# EAGLE design femtoBeacon_r2.0.1 (EAGLE 7.6.0)

## Sheet 1 of 2
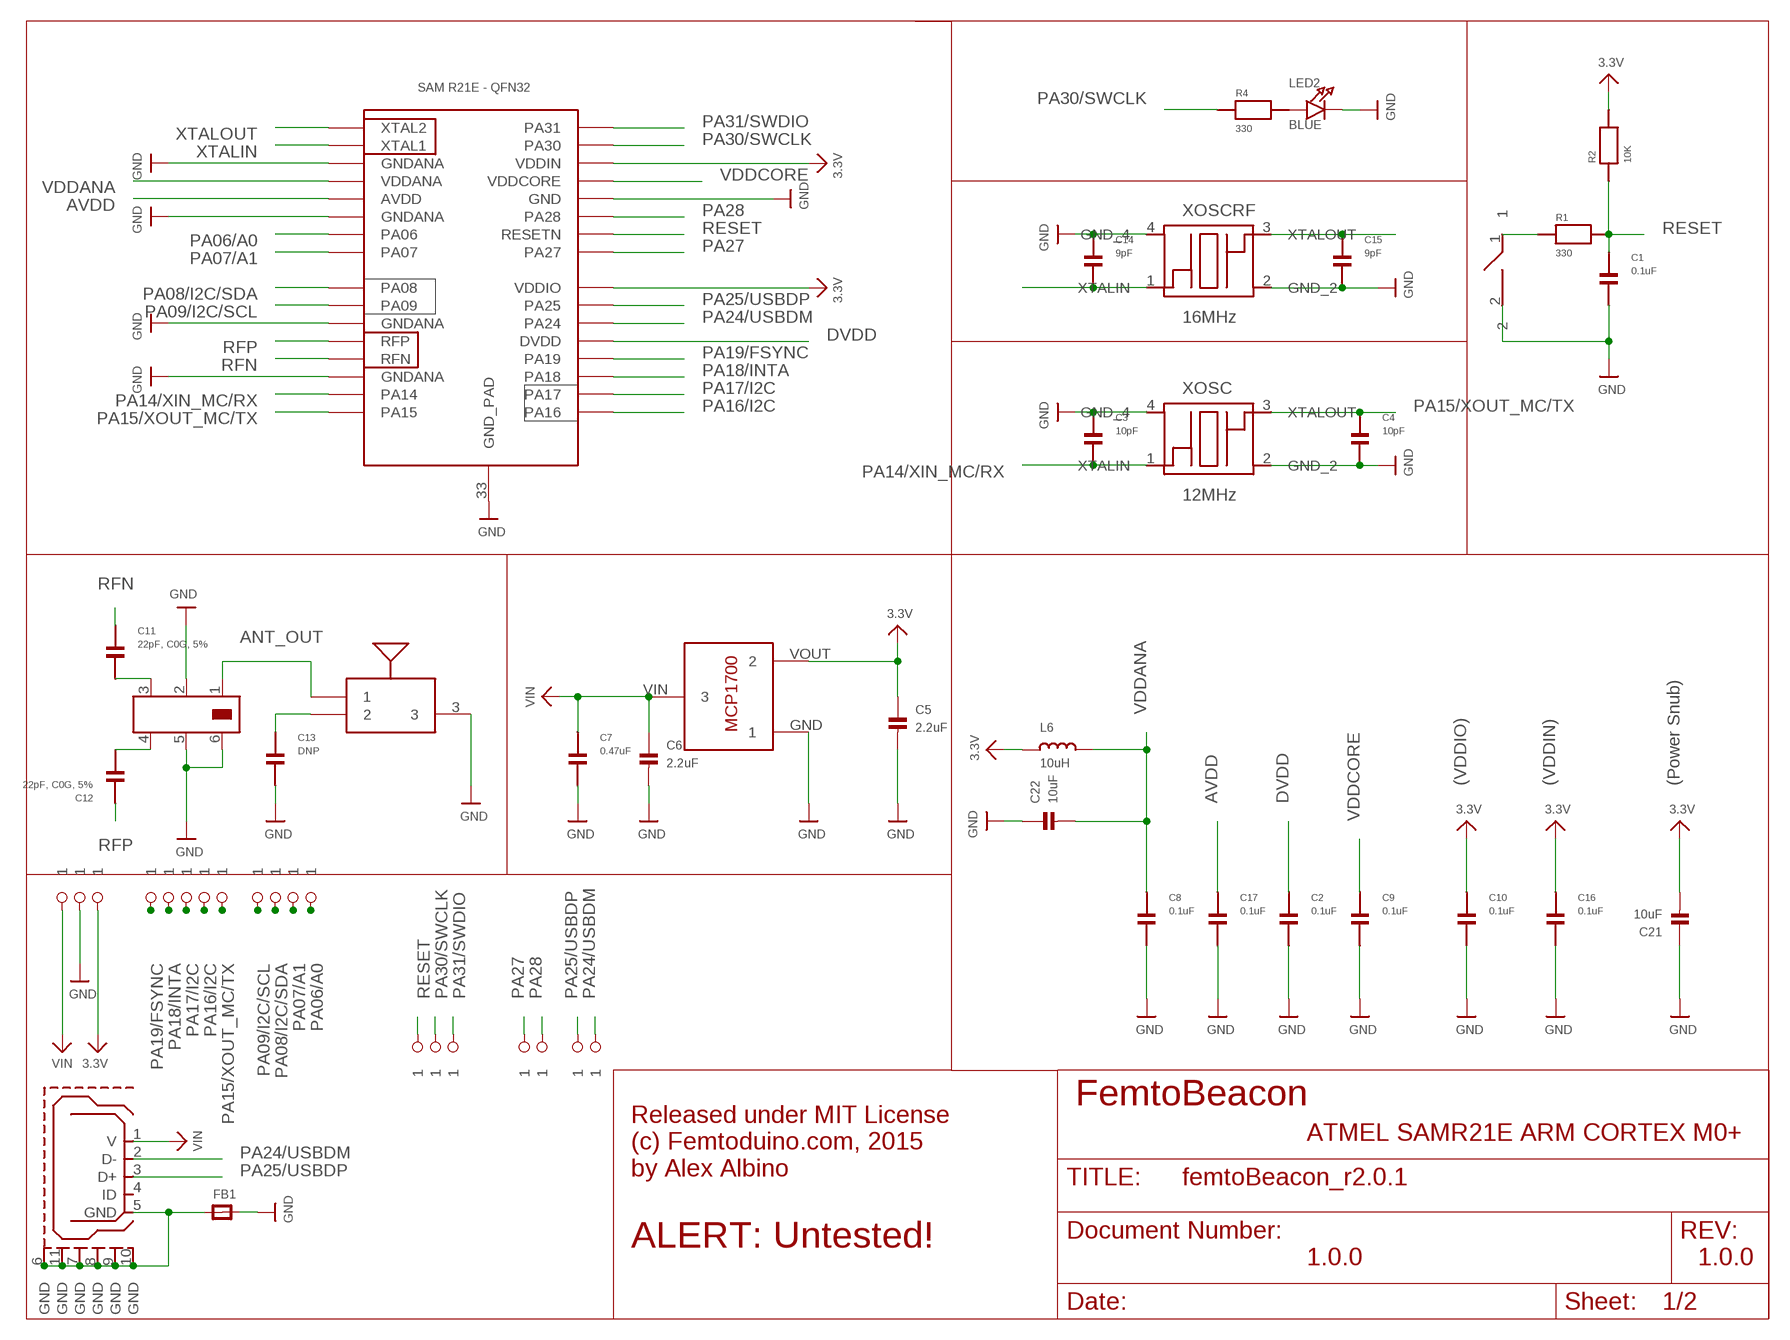
[diagram p0: schematic, sheet 1]

### Parts
ANT1  PULSE_ANT_2.4GHZ  [ANT_BAR]
BAL  JOHANSON_2450BM15A0015E  [0805_BALUN]
BTN  DNP  SPST_SMD  [SPST_SMD]
C1  0.1uF  CAPACITOR_0201  [PART]
C2  0.1uF  CAPACITOR_0201  [PART]
C3  10pF  CAPACITOR_0201  [PART]
C4  10pF  CAPACITOR_0201  [PART]
C5  2.2uF  CAP_CERAMIC_0402MP  [_0402MP]
C6  2.2uF  CAP_CERAMIC_0402MP  [_0402MP]
C7  0.47uF  CAPACITOR_0201  [PART]
C8  0.1uF  CAPACITOR_0201  [PART]
C9  0.1uF  CAPACITOR_0201  [PART]
C10  0.1uF  CAPACITOR_0201  [PART]
C11  22pF, C0G, 5%  CAPACITOR_0201  [PART]
C12  22pF, C0G, 5%  CAPACITOR_0201  [PART]
C13  DNP  CAPACITOR_0201  [PART]
C14  9pF  CAPACITOR_0201  [PART]
C15  9pF  CAPACITOR_0201  [PART]
C16  0.1uF  CAPACITOR_0201  [PART]
C17  0.1uF  CAPACITOR_0201  [PART]
C21  10uF  CAP_CERAMIC_0402MP  [_0402MP]
C22  10uF  CAP_CERAMIC_0402MP  [_0402MP]
FB1  FERRITE_0603MP  [_0603MP]
IC  ATSAMR21E18A-MUT  [QFN32]
L6  10uH  INDUCTOR_0603MP  [_0603MP]
LDO_VREG  MCP1700T-3302E/TT  [MCP1700T-3302E/TT]
LED2  BLUE  LED0603_NOOUTLINE  [CHIPLED_0603_NOOUTLINE]
R1  330  RESISTOR_0201  [PART]
R2  10K  RESISTOR_0201  [PART]
R4  330  RESISTOR_0201  [PART]
U$1  1X1_ROUND  [1X1_ROUND]
U$2  1X1_ROUND  [1X1_ROUND]
U$5  1X1_ROUND  [1X1_ROUND]
U$7  1X1_ROUND  [1X1_ROUND]
U$9  1X1_ROUND  [1X1_ROUND]
U$10  1X1_ROUND  [1X1_ROUND]
U$35  1X1_ROUND  [1X1_ROUND]
U$36  1X1_ROUND  [1X1_ROUND]
U$37  1X1_ROUND  [1X1_ROUND]
U$38  1X1_ROUND  [1X1_ROUND]
U$39  1X1_ROUND  [1X1_ROUND]
U$41  1X1_ROUND  [1X1_ROUND]
U$42  1X1_ROUND  [1X1_ROUND]
U$43  1X1_ROUND  [1X1_ROUND]
U$45  1X1_ROUND  [1X1_ROUND]
U$46  1X1_ROUND  [1X1_ROUND]
U$47  1X1_ROUND  [1X1_ROUND]
U$48  1X1_ROUND  [1X1_ROUND]
U$54  1X1_ROUND  [1X1_ROUND]
USB  USB_MICROB  [USB_MICROB_PACKAGE]
XOSC  12MHz  TSX-3225  [TSX-3225]
XOSCRF  16MHz  TSX-3225  [TSX-3225]

### Nets
3.3V: C5.1 C10.1 C16.1 C21.2 IC.24(VDDIO) IC.30(VDDIN) L6.1 LDO_VREG.VOUT R2.2 U$5.P$1 ; also sheet 2
ANT_OUT: ANT1.1 BAL.1
AVDD: C17.1 IC.5(AVDD)
DVDD: C2.1 IC.21(DVDD)
GND: ANT1.3 BAL.2 BAL.5 BAL.6 BTN.2 C1.2 C2.2 C3.1 C4.2 C5.2 C6.2 C7.2 C8.2 C9.2 C10.2 C13.2 C14.1 C15.2 C16.2 C17.2 C21.1 C22.1 FB1.2 IC.3(GNDANA) IC.6(GNDANA) IC.11(GNDANA) IC.14(GNDANA) IC.28(GND) IC.33(GND_PAD) LDO_VREG.GND LED2.C U$2.P$1 XOSC.2(GND_2) XOSC.4(GND_4) XOSCRF.2(GND_2) XOSCRF.4(GND_4) ; also sheet 2
N$1: BAL.3 C11.2
N$2: ANT1.2 C13.1
N$3: BAL.4 C12.2
N$5: FB1.1 USB.5(GND) USB.6(GND) USB.7(GND) USB.8(GND) USB.9(GND) USB.10(GND) USB.11(GND)
N$13: LED2.A R4.2
N$26: BTN.1 R1.1
PA06/A0: IC.7(PA06) U$54.P$1
PA07/A1: IC.8(PA07) U$43.P$1
PA08/I2C/SDA: IC.9(PA08) U$42.P$1 ; also sheet 2
PA09/I2C/SCL: IC.10(PA09) U$41.P$1 ; also sheet 2
PA14/XIN_MC/RX: C3.2 IC.15(PA14) XOSC.1(XTALIN)
PA15/XOUT_MC/TX: C4.1 IC.16(PA15) U$39.P$1 XOSC.3(XTALOUT)
PA16/I2C: IC.17(PA16) U$38.P$1
PA17/I2C: IC.18(PA17) U$37.P$1
PA18/INTA: IC.19(PA18) U$36.P$1 ; also sheet 2
PA19/FSYNC: IC.20(PA19) U$35.P$1 ; also sheet 2
PA24/USBDM: IC.22(PA24) U$9.P$1 USB.2(D-)
PA25/USBDP: IC.23(PA25) U$10.P$1 USB.3(D+)
PA27: IC.25(PA27) U$7.P$1
PA28: IC.27(PA28) U$48.P$1
PA30/SWCLK: IC.31(PA30) R4.1 U$46.P$1
PA31/SWDIO: IC.32(PA31) U$47.P$1
RESET: C1.1 IC.26(RESETN) R1.2 R2.1 U$45.P$1
RFN: C11.1 IC.13(RFN)
RFP: C12.1 IC.12(RFP)
VDDANA: C8.1 C22.2 IC.4(VDDANA) L6.2
VDDCORE: C9.1 IC.29(VDDCORE)
VIN: C6.1 C7.1 LDO_VREG.VIN U$1.P$1 USB.1(V)
XTALIN: C14.2 IC.2(XTAL1) XOSCRF.1(XTALIN)
XTALOUT: C15.1 IC.1(XTAL2) XOSCRF.3(XTALOUT)
Unconnected: USB.4(ID)

### Notes on the sheet
- (VDDIO) | (VDDIN) | (Power Snub)
- FemtoBeacon
- ATMEL SAMR21E ARM CORTEX M0+
- Released under MIT License
  (c) Femtoduino.com, 2015
  by Alex Albino
- ALERT: Untested!
- 1.0.0 | 1.0.0

## Sheet 2 of 2
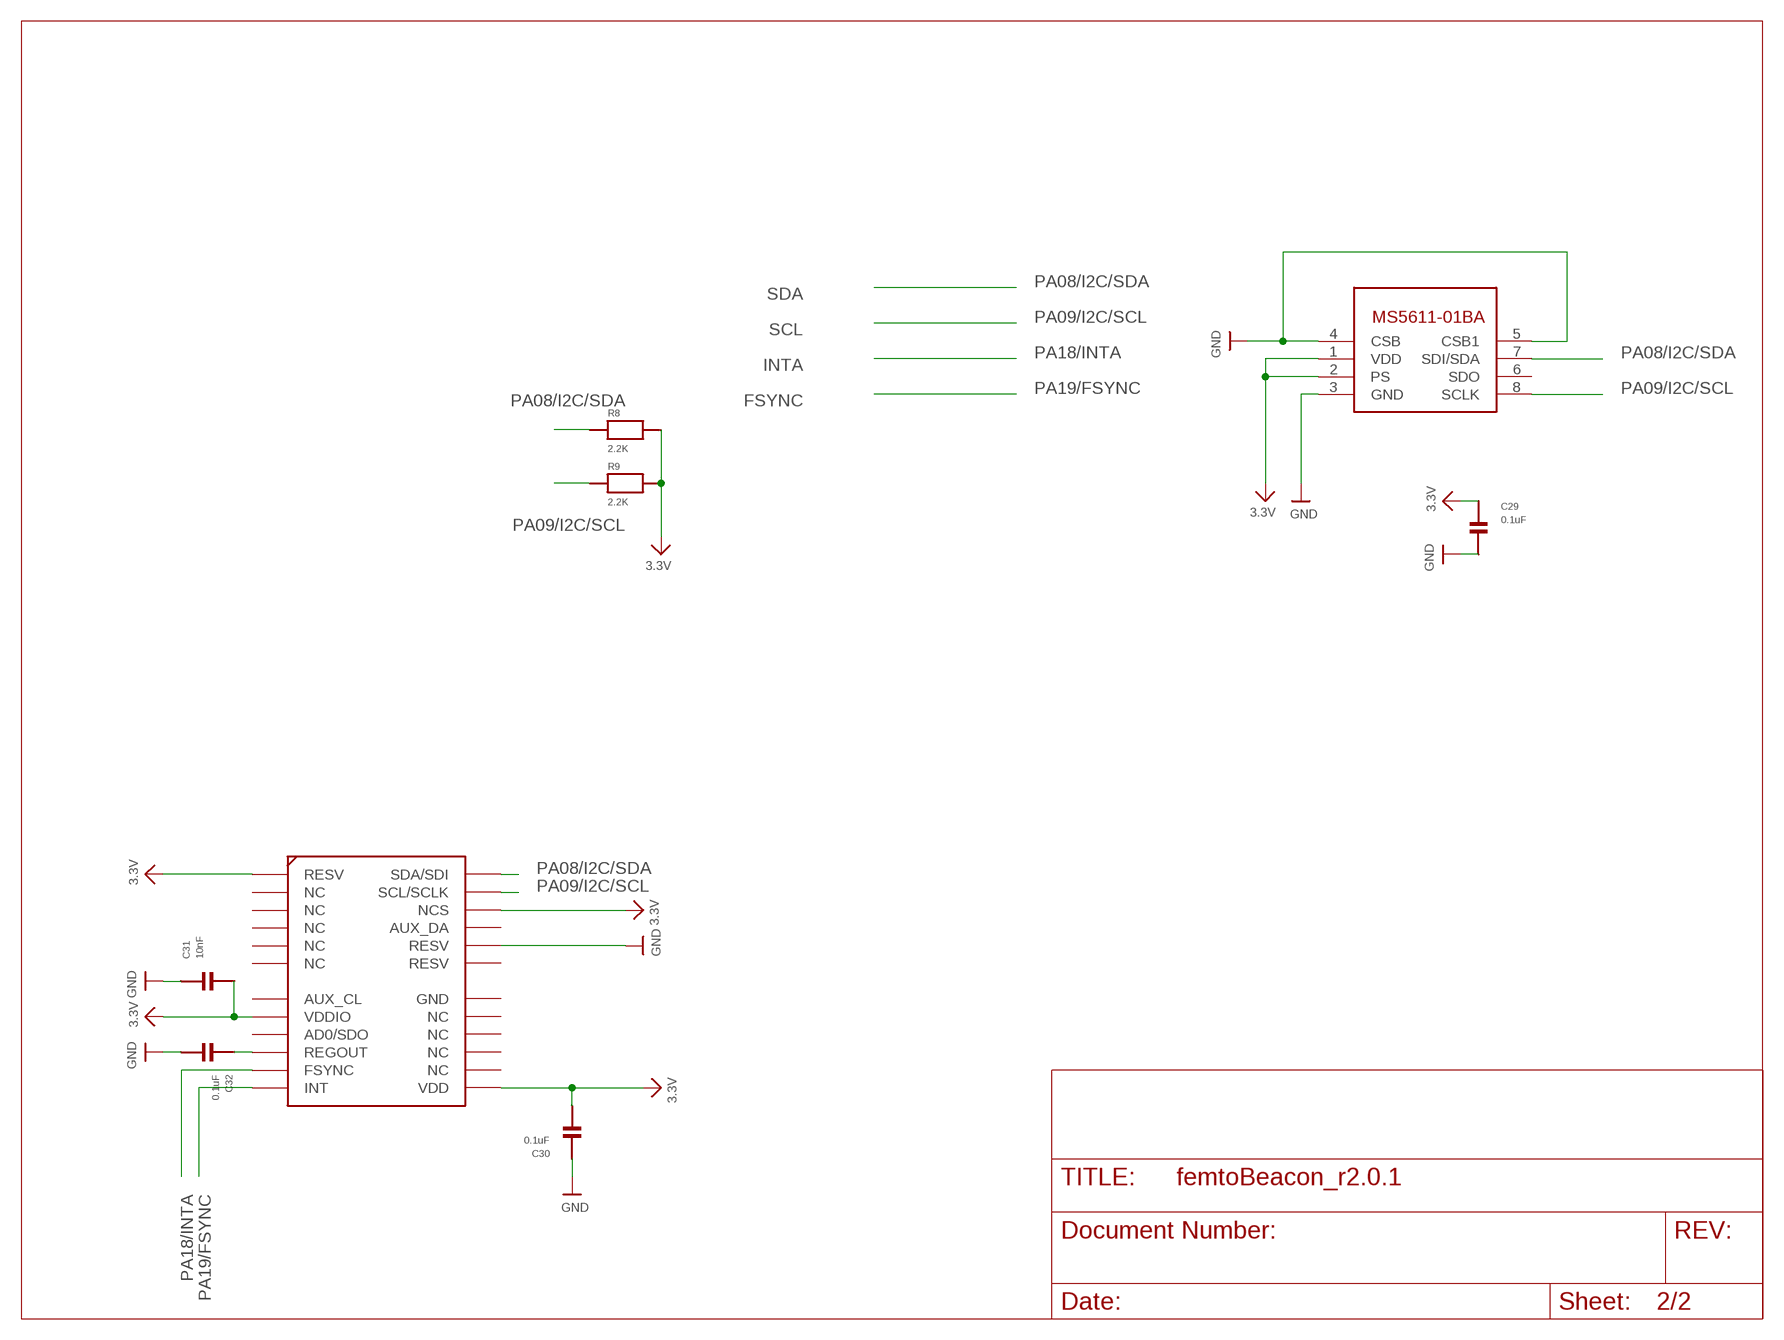
[diagram p1: schematic, sheet 2]

### Parts
BARO  MS5611-01BA03  [MS5611-01BA03]
C29  0.1uF  CAPACITOR_0201  [PART]
C30  0.1uF  CAPACITOR_0201  [PART]
C31  10nF  CAPACITOR_0201  [PART]
C32  0.1uF  CAPACITOR_0201  [PART]
IMU  MPU-9250  [QFN_3X3MM]
R8  2.2K  RESISTOR_0201  [PART]
R9  2.2K  RESISTOR_0201  [PART]

### Nets
3.3V: BARO.1(VDD) BARO.2(PS) C29.1 C30.2 C31.2 IMU.P$1(RESV) IMU.P$8(VDDIO) IMU.P$13(VDD) IMU.P$22(NCS) R8.2 R9.2 ; also sheet 1
GND: BARO.3(GND) BARO.4(CSB) BARO.5(CSB1) C29.2 C30.1 C31.1 C32.2 IMU.P$20(RESV) ; also sheet 1
N$4: C32.1 IMU.P$10(REGOUT)
PA08/I2C/SDA: BARO.7(SDI/SDA) IMU.P$24(SDA/SDI) R8.1 ; also sheet 1
PA09/I2C/SCL: BARO.8(SCLK) IMU.P$23(SCL/SCLK) R9.1 ; also sheet 1
PA18/INTA: IMU.P$11(FSYNC) ; also sheet 1
PA19/FSYNC: IMU.P$12(INT) ; also sheet 1
Unconnected: BARO.6(SDO) IMU.P$2(NC) IMU.P$3(NC) IMU.P$4(NC) IMU.P$5(NC) IMU.P$6(NC) IMU.P$7(AUX_CL) IMU.P$9(AD0/SDO) IMU.P$14(NC) IMU.P$15(NC) IMU.P$16(NC) IMU.P$17(NC) IMU.P$18(GND) IMU.P$19(RESV) IMU.P$21(AUX_DA)

### Notes on the sheet
- SDA
- SCL
- INTA
- FSYNC

## Library data of the parts
ANT1 = bar_antenna:PULSE_ANT_2.4GHZ: Manufacturer part #W3008
BAL = balun:JOHANSON_2450BM15A0015E
BARO = freeimu:MS5611-01BA03
BTN = femtoduino:SPST_SMD
C1 C3 C4 C8-C17 C29-C32 = parts_0201:CAPACITOR_0201; DIGIKEY_PART: 490-3194-1-ND
C2 C7 = parts_0201:CAPACITOR_0201
C5 C6 C21 C22 = microbuilder:CAP_CERAMIC: Ceramic Capacitors 0402 - 0402 Surface Mount Capacitors 16pF 50V 5% [Digikey: 445-4899-2-ND] 18pF 50V 5% [Digikey: 490-1281-2-ND] 22pF 50V 5% [Digikey: 490-1283-2-ND] 68pF 50V 5% [Digikey: 490-1289-2-ND] 0.1uF 10V 10% [Digikey: 490-1318-2-ND] 1.0uF 6.3V 10% [Digikey: 490-1320-2-ND] 0603 - 0603 Surface Mount Capacitors 16 pF 50V 5% [Digikey: 445-5051-2-ND] 22 pF 50V [Digikey: PCC220ACVTR-ND] 33 pF 50V 5% [Digikey: 490-1415-1-ND] 56pF 50V 5% [Digikey: 490-1421-1-ND] 220pF 50V 5% [Digikey: 445-1285-1-ND] 680 pF 50V 2200 pF 50V 5% C0G [Digikey: 445-1297-1-ND] 5600 pF 100V 5% X7R [Digikey: 478-3711-1-ND] 0.1 µF 25V 10% [Digikey: PCC2277TR-ND] 0.22 µF 16V 10% X7R [Digikey: 445-1318-1-ND] 1.0 µF 25V 10% [Digikey: 445-5146-2-ND] 0603 - RF Specific 3pF 250V +/-0.1pF RF [Digikey: 712-1347-1-ND] 18 pF 250V 5% [Digikey: 478-3505-1-ND or 712-1322-1-ND] 56 pF 250V 5% C0G RF [Digikey: 490-4867-1-ND] 68 pF 250V RF [Digikey: 490-4868-1-ND] 0805 - 0805 Surface Mount Capacitors 220 pF 250V 2% RF Ceramic Capacitor [Digikey: 712-1398-1-ND] 1000 pF 50V 2% NP0 Ceramic Capacitor [Digikey: 478-3760-1-ND] 0.1 µF 25V 10% Ceramic Capacitor [Digikey: PCC1828TR-ND] 1.0 µF 16V 10% Ceramic Capacitor[Digikey: 490-1691-2-ND] 10.0 µF 10V 10% Ceramic Capacitor[Digikey: 709-1228-1-ND] 10.0 uF 16V 10% Ceramic Capacitor [Digikey: 478-5165-2-ND] 47 uF 6.3V 20% Ceramic Capacitor [Digikey: 587-1779-1-ND or 399-5506-1-ND] 1206 - 1206 Surface Mount Capacitors 47uF 10V 20% Ceramic Capacitor [Digikey: 490-5528-1-ND or 399-5508-1-ND or 445-6010-1-ND] 100uF 6.3V -20%, +80% Y5V Ceramic Capacitor (Digikey: 490-4512-1-ND, Mouser: 81-GRM31CF50J107ZE1L)
FB1 = microbuilder:FERRITE: Ferrite Bead 0603 MMZ1608B121C - 120 Ohm @ 100MHz, 600mA, 0.15 Ohm DC Resistance - Digikey: 445-2164-1-ND BK1608HW121-T - 120 Ohm, 600mA Ferrite Chip - Digikey: 587-1876-2-ND 0805 HZ0805B272R-10 - 2.7K Ohm @ 100MHz, 200mA, 0.8 Ohm DC Resistance - Digikey: 240-2504-1-ND (see also Murata BLM21BD272SN1L) MMZ2012Y152B - 1.5K Ohm @ 100MHz, 500mA, 0.4 Ohm DC Resistance - Digikey: 445-1560-1-ND - Mainly for high frequency (80-400MHz) MMZ2012R102A - 1K Ohm @ 100MHz, 500mA, 0.3 Ohm DC Resistance - Digikey: 445-1555-2-ND - More general purpose (10-200MHz)
IC = atmel-samr21:ATSAMR21E18A-MUT: This is the ATMEL SAMR21E QFN-32. ATSAMR21E18A
IMU = mpu9250:MPU-9250
L6 = microbuilder:INDUCTOR: Inductors 0603: 10nH Ceramic Inductor - microwire antenna/RF (Digikey: 712-1434-2-ND) 0805: 560nH Ceramic Inductor - RF (Digikey: 553-1047-1-ND) 270nH Ceramic Inductor - Q = 40@250MHz, +-5%, 1 Ohm DC Resistance (Digikey: 535-10506-2-ND) 1007 (2518 Metric) SMT: 10µH 10% 250mOhm 820mA 1007 Inductor (Digikey: 587-2189-1-ND) 22µH 10% 500mOhm 580mA 1007 Inductor (Digikey: 587-2190-1-ND) 47µH 10% 950mOhm 420mA 1007 Inductor (Digikey: 587-2191-1-ND) 47µH 5% 100mOhm 1A 1008 Inductor (Digikey: 732-1816-1-ND) 5.0x5.0mm (Taiyo Yuden NR5040 Series) 6.8µH 20% 2.3A 64mOhm Inductor (Digikey: 587-2374-2-ND) 5.0x5.0mm (TDK VLC5045 Series) 4.7µH 20% 3.3A 34mOhm Inductor (Digikey: 445-6526-1-ND) 6.8µH 20% 2.7A 46mOhm Inductor (Digikey: 445-6527-1-ND) 6.0x6.0mm (TDK VLC6045 Series) 4.7µH 20% 3.8A 27mOhm Inductor (Digikey: 445-6538-2-ND) 6.8µH 20% 3A 41mOhm Inductor (Digikey: 445-6540-1-ND) 6.2µH 30% 2.2A 45mOhm Inductor (Digikey: SRR5028-6R2YCT-ND) - Not TDK VLC6045 but footprint should match 6.0x6.0mm (TDK SLF6045 Series) 6.8uH 30% 2A 33mOhm Inductor (Digikey: 445-4572-1-ND, Mouser: 810-SLF645T6R8N2R0PF)
LDO_VREG = MCP1700T-3302E_TT:MCP1700T-3302E/TT: Microchip LDO "MCP1700" in a 3-Pin SOT-23 package. ID: MCP1700T-3302E/TT
LED2 = microbuilder:LED: LED 0603 - 0603 Surface Mount Package 2mA: Green LED - Low Power (3.9mcd, 2ma, 1.7Vf) - Digikey: 475-2709-2-ND Orange LED - Low Power (9.8mcd, 2ma, 1.8Vf) - Digikey: 475-1194-2-ND Red LED - Low Power (5mcd, 2ma, 1.8Vf) - Digikey: 475-1195-2-ND Yellow LED - Low Power (7mcd, 2ma, 1.8Vf) - Digikey: 475-1196-2-ND 5mA: Blue LED - Low Power (17mcd, 5ma, 2.9Vf) - Digikey: LNJ937W8CRACT-ND 0805 - 0805 Surface Mount Package 2mA: Red LED (8.8mcd, 2mA, 1.8Vf, Clear) - Low Power [Digikey: 475-2510-1-ND] Green LED (5mcd, 2mA, 1.8Vf, Clear) - Low Power [Digikey: 475-2730-1-ND] Yellow LED (11.3mcd, 2mA, 1.8Vf, Clear) - Low Power [Digikey: 475-2555-1-ND] 20mA: Red LED (104mcd, 20mA, Diffused) - LS R976 [Digikey: 475-1278-6-ND] Red LED (12mcd, 20mA, 2.0Vf, Clear) - APT2012EC [Digikey: 754-1128-1-ND] Green LED (15mcd, 20mA, 2.2Vf, Clear) - APT2012GC [Digikey: 754-1131-1-ND] Orange LED (160mcd, 20mA, 2.1Vf, Clear) - APT2012SECK [Digikey: 754-1130-1-ND] 1206 - 1206 Surface Mount Package Green LED (26mcd, 20mA, Diffused) - LG N971 [Digikey: 475-1407-6-ND] Red LED (15mcd, 20mA, Diffused) - LH N974 [Digikey: 475-1416-6-ND]
R1 R2 R4 R8 R9 = parts_0201:RESISTOR_0201
U$1 U$2 U$5 U$7 U$9 U$10 U$35-U$39 U$41-U$43 U$45-U$48 U$54 = pins_1.27mm_pitch:1X1_ROUND
USB = femtoduino:USB_MICROB: This is the hirose ZX62-B-5PA(11) MICRO-USB B Type female connection.
XOSC XOSCRF = crystals:TSX-3225

## Board
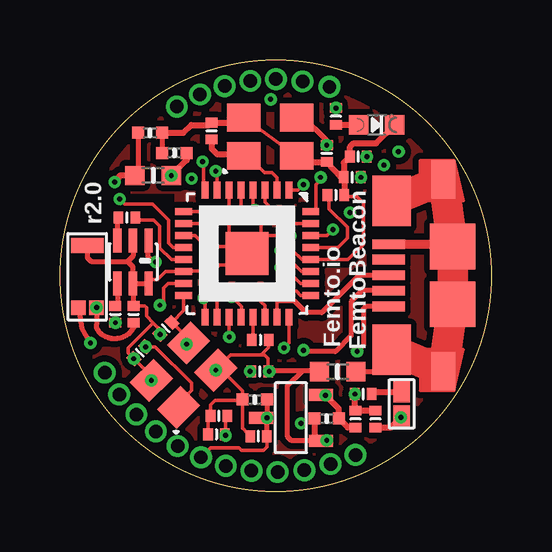
[diagram p2: board, top side]
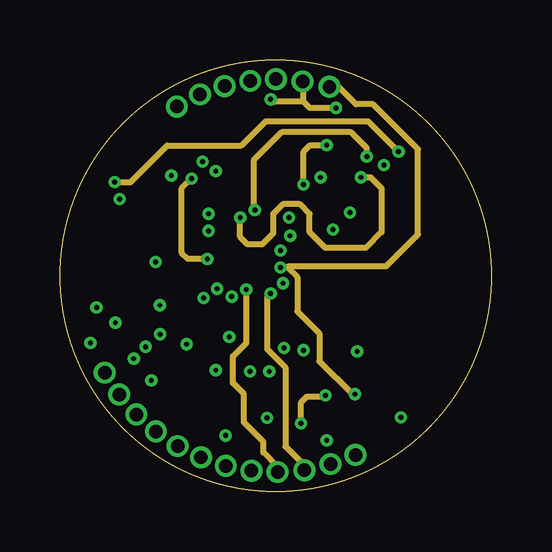
[diagram p3: board, inner layer Route2]
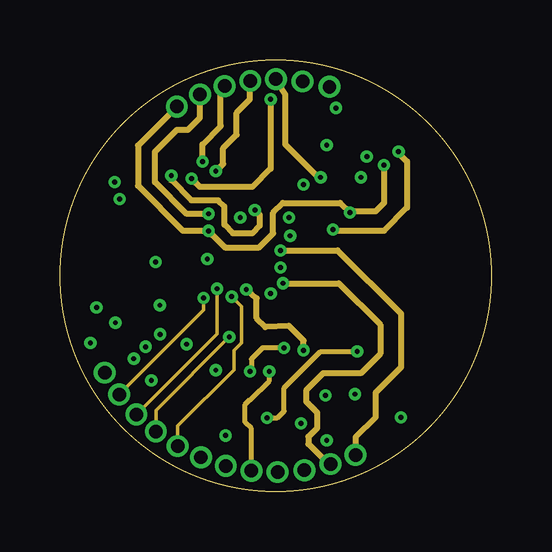
[diagram p4: board, inner layer Route15]
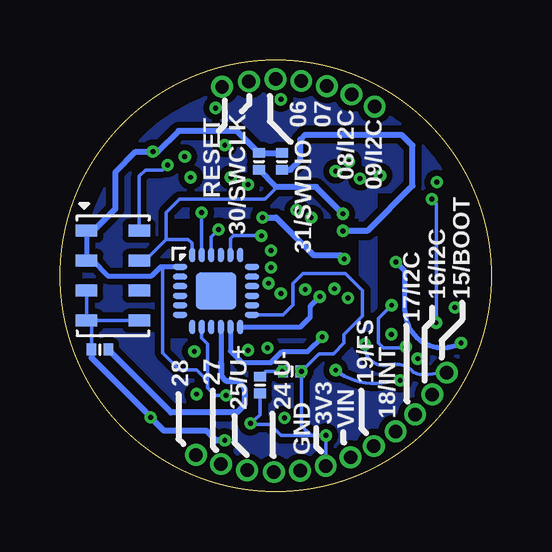
[diagram p5: board, bottom side, seen from below]

Size 18 x 18 mm. Coordinates in mm from the lower left corner, seen from the top.
Outline: circle at 9,9 radius 9
Copper layers (1+2*15+16): Top 0.035mm / dielectric 0.7mm / Route2 0.035mm / dielectric 0.15mm / Route15 0.035mm / dielectric 0.2mm / Bottom 0.035mm
Design rules "AQS_custom_4layer": minimum track width 5mil, minimum drill 5mil, track to track 6mil, track to pad 6mil, pad to pad 6mil, via to via 6mil, smd to smd 1mil, copper to edge 15mil, drill to drill 6mil, minimum pad ring 7mil, minimum via ring 3mil, stop-mask expansion 2mil, vias tented up to drill 10mil, thermal gap 10mil

### Footprints (pad centres in the part's own frame; a part is rotated, then mirrored left to right if it is on the bottom)
ANT_BAR = smd 0.62 x 0.61: 1 -1.3,0.37; 2 -1.3,-0.38 | smd 0.62 x 1.36: 3 1.3,0
0805_BALUN = smd 1 x 0.35: 1 -0.9,0.65; 2 -0.9,0; 3 -0.9,-0.65; 4 0.9,-0.65; 5 0.9,0; 6 0.9,0.65
MS5611-01BA03 = smd 0.9 x 0.5: 1 -1.1,1.875; 2 -1.1,0.625; 3 -1.1,-0.625; 4 -1.1,-1.875; 5 1.1,-1.875; 6 1.1,-0.625; 7 1.1,0.625; 8 1.1,1.875
SPST_SMD = smd 0.889 x 0.699: 1 -0.508,0; 2 0.508,0
PART = smd 0.4 x 0.5: 1 -0.35,0; 2 0.35,0
_0402MP = smd 0.5 x 0.5: 1 -0.508,0; 2 0.508,0
_0603MP = smd 0.8 x 0.8: 1 -0.762,0; 2 0.762,0
QFN32 = smd 0.7 x 0.3: 1 -2.65,1.75; 2 -2.65,1.25; 3 -2.65,0.75; 4 -2.65,0.25; 5 -2.65,-0.25; 6 -2.65,-0.75; 7 -2.65,-1.25; 8 -2.65,-1.75; 17 2.65,-1.75; 18 2.65,-1.25; 19 2.65,-0.75; 20 2.65,-0.25; 21 2.65,0.25; 22 2.65,0.75; 23 2.65,1.25; 24 2.65,1.75 | smd 0.3 x 0.7: 9 -1.75,-2.65; 10 -1.25,-2.65; 11 -0.75,-2.65; 12 -0.25,-2.65; 13 0.25,-2.65; 14 0.75,-2.65; 15 1.25,-2.65; 16 1.75,-2.65; 25 1.75,2.65; 26 1.25,2.65; 27 0.75,2.65; 28 0.25,2.65; 29 -0.25,2.65; 30 -0.75,2.65; 31 -1.25,2.65; 32 -1.75,2.65 | smd 1.8 x 1.8: 33 0,0
QFN_3X3MM = smd 0.6 x 0.25: P$1 -1.5,1; P$2 -1.5,0.6; P$3 -1.5,0.2; P$4 -1.5,-0.2; P$5 -1.5,-0.6; P$6 -1.5,-1; P$13 1.5,-1; P$14 1.5,-0.6; P$15 1.5,-0.2; P$16 1.5,0.2; P$17 1.5,0.6; P$18 1.5,1 | smd 0.25 x 0.6: P$7 -1,-1.5; P$8 -0.6,-1.5; P$9 -0.2,-1.5; P$10 0.2,-1.5; P$11 0.6,-1.5; P$12 1,-1.5; P$19 1,1.5; P$20 0.6,1.5; P$21 0.2,1.5; P$22 -0.2,1.5; P$23 -0.6,1.5; P$24 -1,1.5 | smd 1.7 x 1.54: P$25 0,0
MCP1700T-3302E/TT = smd 0.5 x 1: GND -0.95,-1.25; VIN 0,1.25; VOUT 0.95,-1.25
CHIPLED_0603_NOOUTLINE = smd 0.8 x 0.8: A 0,-0.75; C 0,0.75
1X1_ROUND = drill 0.559 pad 0.864: P$1 0,0
USB_MICROB_PACKAGE = smd 0.4 x 1.35: 1 -1.3,1.47; 2 -0.64,1.47; 3 0,1.47; 4 0.66,1.47; 5 1.3,1.47 | smd 2.1 x 1.6: 6 -3.1,1.35; 11 3.1,1.35 | smd 1.6 x 1: 7 -4,-0.8; 10 4,-0.8 | smd 1.9 x 1.9: 8 -1.2,-1.2; 9 1.2,-1.2
TSX-3225 = smd 1.4 x 1.15: 1 -1.1,-0.8; 2 1.1,-0.8; 3 1.1,0.8; 4 -1.1,0.8

### Placement (x,y rotation side)
ANT1  1.14,8.97 90 top
BAL  3.05,9.58 270 top
BARO  15.79,9.01 0 bottom
BTN  14.25,3.66 270 top
C1  13.16,3.02 270 top
C2  8.36,6.32 0 top
C3  3.33,5.79 45 top
C4  4.42,6.81 225 top
C5  11.13,3.05 180 top
C6  8.13,3.83 180 top
C7  8.28,2.31 180 top
C8  12.45,13.97 180 top
C9  11.51,12.37 0 top
C10  6.63,3.15 180 top
C11  2.79,11.43 180 top
C12  2.31,7.39 90 top
C13  3.07,7.39 90 top
C14  6.32,15.04 270 top
C15  11.13,14.1 270 top
C16  8.33,5.02 0 top
C17  12.19,13.11 180 top
C21  3.76,14.96 180 top
C22  4.78,14.12 0 top
C29  9.65,4.45 90 bottom
C30  8.33,5.02 0 bottom
C31  6.53,2.39 0 top
C32  16.33,5.92 180 bottom
FB1  11.58,5 180 top
IC  7.81,9.92 270 top
IMU  11.49,8.37 0 bottom
L6  3.89,13.18 0 top
LDO_VREG  9.64,3.07 90 top
LED2  13.21,15.29 270 top
R1  12.65,4.06 180 top
R2  12.32,3.02 270 top
R4  11.51,15.65 270 top
R8  9.7,13.77 90 bottom
R9  8.74,13.77 90 bottom
U$1  5.88,1.43 0 top
U$2  7.98,0.87 0 top
U$5  6.92,1.07 0 top
U$7  11.29,1.15 0 top
U$9  9.08,0.81 0 top
U$10  10.19,0.89 0 top
U$35  4.91,1.9 0 top
U$36  4,2.5 0 top
U$37  3.19,3.21 0 top
U$38  2.48,4.05 0 top
U$39  1.87,4.96 0 top
U$41  4.88,16.06 0 top
U$42  5.84,16.56 0 top
U$43  6.87,16.91 0 top
U$45  11.24,16.88 0 top
U$46  10.12,17.1 0 top
U$47  9,17.2 0 top
U$48  12.33,1.52 0 top
U$54  7.94,17.13 0 top
USB  15.18,9.02 90 top
XOSC  5.16,4.85 45 top
XOSCRF  8.77,14.8 0 top

### Tracks (layer width: path | path; a pad name or v marks a point on that pad's centre or on a via)
3.3V  (via drill 0.2 pad 0.51)
  Top 0.14: C31.2 6.88,2.32 v6.91,2.34
  Top 0.152: C30.2 7.93,5.12 v7.93,5.02 | IC.24 9.56,6.19 v9.35,5.99 | C10.1 7.01,3.31 6.91,3.21 v6.91,2.34 | LDO_VREG.VOUT 11.06,4.03 v11.07,4.01 | IC.30 11.13,10.67 v11.38,10.92
  Top 0.203: C21.2 3.25,13.31
  Top 0.254: 3.25,13.31 L6.1 2.52,13.18 v2.29,12.9 | v11.07,4.01 11.63,3.45 C5.1 12.01,2.67 R2.2
  Route2 0.254: v2.29,12.9 2.95,12.9 4.47,14.43 7.57,14.43 8.59,15.44 12.85,15.44 v14.12,14.17 | v10.06,2.85 10.06,3.71 10.31,3.96 11.02,3.96 v11.07,4.01
  Route15 0.203: v9.35,5.99 8.45,5.99 7.98,5.52 7.98,5.07 v7.93,5.02
  Route15 0.254: v14.12,14.17 14.12,14.12 14.48,13.77 14.48,11.84 13.51,10.87 11.43,10.87 v11.38,10.92
  Bottom 0.14: v6.91,2.34 U$5.P$1 | v7.93,5.02 C30.2
  Bottom 0.152: 7.52,2.34 8.79,2.34 9.24,2.79 10.01,2.79 v10.06,2.85 9.65,3.2 C29.1 | 7.52,2.34 v6.91,2.34 | 7.52,2.34 7.93,2.75 v7.93,5.02 7.21,5.74 6.6,5.74 6.15,6.2 6.15,6.55 5.38,7.32 5.38,8.38 6.1,9.09 7.87,9.09 8.28,8.69 8.28,7.77 8.69,7.37 IMU.P$13 | IMU.P$8 12.09,6.4 11.84,6.15 11.84,4.62 | 11.84,4.62 11.84,4.32 11.53,4.01 v11.07,4.01 | IMU.P$22 11.69,10.61 v11.38,10.92 | 11.84,4.62 12.29,5.08 13.01,5.08 13.72,5.79 13.72,9.31 13.66,9.37
  Bottom 0.203: BARO.1 BARO.2 16.64,9.63 16,8.99 14.17,8.99 13.8,9.37 13.66,9.37 IMU.P$1
  Bottom 0.254: BARO.1 16.6,10.88 15.7,11.79 15.7,13.31 14.83,14.17 v14.12,14.17 13.92,14.17 13.06,15.04 10.62,15.04 R8.2 R9.2
ANT_OUT  (via drill 0.2 pad 0.51)
  Top 0.203: v3.99,9.58 3.83,9.63 3.68,9.78 3.68,10.46 BAL.1 | ANT1.1 0.91,6.81 v1.27,6.2
  Bottom 0.203: v1.27,6.2 1.37,6.15 arc114 3.61,7.52 3.61,9.2 v3.99,9.58
AVDD  (via drill 0.2 pad 0.51)
  Top 0.152: IC.5 7.56,11.47 v7.52,11.43
  Top 0.254: C17.1 v12.55,13.11
  Route2 0.254: v12.55,13.11 12.96,13.11 13.41,12.65 13.41,10.82 12.75,10.16 11.07,10.16 10.41,10.82 10.41,11.58 10.01,11.99 9.3,11.99 8.89,11.58 8.89,10.77 8.43,10.31 7.82,10.31 7.52,10.62 v7.52,11.43
DVDD
  Top 0.14: IC.21 8.06,6.37 C2.1
GND  (via drill 0.2 pad 0.51)
  Top 0.14: IC.14 5.18,9.2 | 7.06,9.45 7.54,9.92 IC.33 | 3.7,8.84 BAL.6 | 3.89,7.04 4.17,6.75 C4.2 | C3.1 3.79,4.84 XOSC.4 | v8.73,5.02 C30.1 8.68,5.54 8.53,5.69 8.38,5.69 | 8.38,5.69 7.11,5.69 XOSC.2 | C2.2 8.71,6.01 8.38,5.69 | 10.82,5.08 10.77,5.03
  Top 0.152: 5.18,9.2 6.4,9.2 6.66,9.45 7.06,9.45 | IC.14 4.4,9.17 4.06,8.84 3.7,8.84 | 6.23,15.29 C14.1 | XOSCRF.4 XOSCRF.2 | C3.1 2.85,5.78 2.85,5.99 3.89,7.04 3.61,7.32 3.61,7.67 3.54,7.74 C13.2 | C31.1 6.18,3.17 C10.2 6.28,3.61 6.48,3.81 7.59,3.81 C6.2 | C7.2 7.65,2.62 7.62,2.64 C6.2 | IC.11 5.63,10.67 6.1,10.21 7.52,10.21 IC.33 | IC.6 7.06,11.83 6.96,11.73 6.96,11.18 7.06,11.07 7.06,10.67 IC.33 | IC.3 8.56,12.07 8.69,11.94 8.69,11.43 8.38,11.12 8.38,10.5 IC.33 | LDO_VREG.GND 11.12,2.12 v11.12,2.13 | BTN.2 14.25,3.12 v14.22,3.1 | C9.2 11.88,12.29 12.39,12.29 12.65,12.04 12.65,10.31 12.01,9.67 IC.28 10.09,9.67 9.7,10.06 9.7,10.57 v9.6,10.67 8.55,10.67 IC.33 | C6.2 7.62,4.19 6.75,5.06 XOSC.2
  Top 0.203: ANT1.3 1.14,9.75 1.29,9.6 2.82,9.6 | BAL.5 3.05,9.37 2.82,9.6 | BAL.2 3.05,9.83 2.82,9.6 | BAL.5 3.05,7.77 C13.2 | BAL.5 BAL.6 | C21.1 C22.1 | 10.77,5.03 10.11,5.03 | 10.11,5.03 8.74,5.03 v8.73,5.02 | 10.82,5.08 FB1.2 | 10.78,2.24 LDO_VREG.GND 9.66,2.12 9.5,2.29 9.5,4.42 10.11,5.03
  Top 0.254: C21.1 5.16,14.96 5.49,15.29 6.23,15.29 | C14.1 7.26,15.39 XOSCRF.4 | XOSCRF.2 10.12,13.75 C15.2 11.72,13.11 C17.2 | C17.2 11.84,13.71 C8.2 12.1,14.38 12.24,14.53 13.2,14.53 LED2.C | C17.2 11.86,13.09 C9.2 | C1.2 13.8,2.67 v14.22,3.1 | C5.2 10.62,2.12 LDO_VREG.GND
  Route15 0.203: U$2.P$1 7.98,2.63 7.72,2.9 7.72,3.63 7.93,3.83 7.95,3.83 8.73,4.62 v8.73,5.02
  Bottom 0.14: XOSC.4 4.57,4.52 arc46 XOSC.2 | C30.1 v8.73,5.02 9.43,5.02 C29.2
  Bottom 0.152: IMU.P$20 10.89,10.55 10.77,10.67 v9.6,10.67 | BARO.5 BARO.4 | BARO.3 BARO.4 | C32.2 16.68,6.92 BARO.4
  Bottom 0.254: v11.12,2.13 11.48,2.13 11.89,2.54 13.66,2.54 v14.22,3.1 14.25,3.12 BTN.2 16.68,5.58 C32.2
  other vias: 3.81,4.64 6.5,5.06 4.17,6.56 3.08,5.54
N$1
  Top 0.203: BAL.3 2.4,11.38 C11.2
N$2  (via drill 0.2 pad 0.51)
  Top 0.203: ANT1.2 1.52,7.7 ANT1.2 1.52,6.96 arc48 1.57,6.76 arc42 1.83,6.5 arc90 3.07,6.83 C13.1
  other vias: 1.52,7.67
N$3
  Top 0.203: BAL.4 2.4,7.62 C12.2
N$4
  Bottom 0.203: 15.96,5.94 C32.1 | IMU.P$10 11.29,5.37
  Bottom 0.254: 11.29,5.37 11.29,4.84 11.07,4.62 10.62,4.62 10.31,4.32 10.31,3.61 10.62,3.3 13.37,3.3 C32.1
N$5
  Top 0.203: FB1.1 13.27,5 USB.6 | 16.28,10.32 USB.9
  Top 0.381: USB.5 16.28,10.32 arc-90 USB.9
  Top 0.508: 16.38,12.62 USB.10 | 16.38,5.42 USB.7
  Top 1.27: USB.11 USB.10 USB.9 USB.8 USB.7 USB.6
N$6
  pour Top (isolate 0.254): 2.03,13.33 2.03,12.5 4.83,12.5 4.83,8.2 arc-10 4.42,7.24 arc-10 3.15,6.1 arc-10 1.4,5.97 1.4,5.43 arc60 9,1 arc90 17,9 arc90 9,17 arc60
  pour Bottom (isolate 0.254): 2.03,13.33 2.03,12.5 4.83,12.5 4.83,10.79 5.46,10.79 5.46,11.43 13.46,11.43 13.46,6.35 5.46,6.35 5.46,10.77 4.83,10.77 4.83,5.97 1.4,5.97 1.4,5.43 arc60 9,1 arc90 17,9 arc90 9,17 arc60
N$13
  Top 0.152: 12.41,15.3 LED2.A
  Top 0.254: R4.2 12.41,15.3
N$26
  Top 0.254: R1.1 13.1,4.17 BTN.1
PA06/A0  (via drill 0.2 pad 0.51)
  Top 0.152: IC.7 6.56,13.31 v6.5,13.36
  Route15 0.254: v6.5,13.36 6.81,13.66 6.81,14.33 7.37,14.88 7.37,15.8 7.92,16.36 7.92,17.11 U$54.P$1
PA07/A1  (via drill 0.2 pad 0.51)
  Top 0.152: IC.8 6.06,12.69 5.99,12.85 5.99,13.72 v5.94,13.77
  Route15 0.254: v5.94,13.77 5.94,14.48 6.71,15.24 6.71,16.75 U$43.P$1
PA08/I2C/SDA  (via drill 0.2 pad 0.51)
  Top 0.152: IC.9 6.08,11.67 v6.2,11.58
  Route15 0.254: v6.2,11.58 5.28,11.58 3.96,12.9 3.96,14.17 4.88,15.09 5.33,15.09 5.84,15.59 U$42.P$1
  Bottom 0.152: IMU.P$24 12.49,10.36 12.65,10.52 13.56,10.52 | 13.56,10.52 14.45,9.63 BARO.7 | 13.56,10.52 13.56,11.63 13.01,12.19 9.45,12.19 8.94,12.7
  Bottom 0.254: v6.2,11.58 7.32,12.7 8.94,12.7 8.99,12.7 R8.1
PA09/I2C/SCL  (via drill 0.2 pad 0.51)
  Top 0.152: IC.10 5.9,11.17 v6.2,10.87
  Route15 0.254: U$41.P$1 3.25,14.43 3.25,12.75 5.13,10.87 v6.2,10.87 6.91,10.16 8.28,10.16 8.89,10.77 8.89,11.63 9.3,12.04 11.68,12.04 v12.09,11.63 12.24,11.68 13.16,11.68 13.51,12.04 v13.51,13.61
  Bottom 0.152: IMU.P$23 12.09,11.43 v12.09,11.63 | BARO.8 14.69,13.15 14.43,13.41 13.72,13.41 v13.51,13.61
  Bottom 0.254: v6.2,10.87 5.18,10.87 3.3,12.75 3.3,14.43 3.76,14.88 7.77,14.88 7.98,14.68 7.98,13.82 8.38,13.42 R9.1
PA14/XIN_MC/RX  (via drill 0.2 pad 0.51)
  Top 0.152: XOSC.1 4.92,3.65 5.49,4.22 5.49,4.52 3.97,6.04 C3.2 | IC.15 4.51,8.67 4.32,8.48 4.32,7.92 v4.17,7.77
  Bottom 0.152: v4.17,7.77 4.72,7.21 4.72,6.2 4.51,5.99 3.63,5.99 C3.2
  other vias: 3.57,6.04
PA15/XOUT_MC/TX  (via drill 0.2 pad 0.51)
  Top 0.14: IC.16 5.16,7.54 C4.1 5.28,6.44 v5.28,6.15 5.31,6.15 XOSC.3
  Bottom 0.14: 3.76,5.28 arc-25 4.32,5.28 arc109 v5.28,6.15
  Bottom 0.152: 3.76,5.28 arc36 3.25,4.98 arc-31 2.64,4.88 U$39.P$1
PA16/I2C  (via drill 0.2 pad 0.51)
  Top 0.14: IC.17 6.06,7.99 v5.99,8.08
  Route15 0.152: U$38.P$1 5.99,7.57 v5.99,8.08
PA17/I2C  (via drill 0.2 pad 0.51)
  Top 0.14: IC.18 6.55,7.32 v6.55,8.46
  Route15 0.152: U$37.P$1 6.55,6.58 v6.55,8.46
PA18/INTA  (via drill 0.2 pad 0.51)
  Top 0.14: IC.19 v7.06,6.45
  Route15 0.152: v7.06,6.45 4,3.39 U$36.P$1
  Bottom 0.203: IMU.P$11 10.89,5.86 10.41,5.38 9.2,5.38 8.74,5.84 7.67,5.84 v7.06,6.45
PA19/FSYNC  (via drill 0.2 pad 0.51)
  Top 0.14: IC.20 7.57,7.36 7.57,7.72 v7.16,8.13
  Route15 0.152: U$35.P$1 4.92,2.73 7.26,5.08 7.26,5.89 7.57,6.2 7.57,7.72 v7.16,8.13
  Bottom 0.203: IMU.P$12 7.96,6.87 IC.20 7.56,7.74 v7.16,8.13
PA24/USBDM  (via drill 0.2 pad 0.51)
  Top 0.14: IC.22 8.56,7.75 v7.77,8.43
  Top 0.203: USB.2 12.59,8.38 12.14,7.92 12.14,6.5 11.48,5.84 10.21,5.84 v10.16,5.89
  Route2 0.254: U$9.P$1 9.08,1.03 8.48,1.63 8.48,2.08 7.67,2.9 7.67,4.06 7.21,4.52 7.21,5.64 7.77,6.2 v7.77,8.43
  Route15 0.254: v10.16,5.89 10.16,6.3 9.55,6.91 8.56,6.86 8.2,7.22 8.2,8.05 v7.77,8.43
PA25/USBDP  (via drill 0.2 pad 0.51)
  Top 0.152: IC.23 9.06,7.99 v8.79,8.26
  Top 0.203: USB.3 12.47,9.02 10.92,7.47 10.26,7.47 9.78,7.95 9.09,7.95 v8.79,8.26
  Route2 0.254: v8.79,8.26 8.64,8.1 8.64,5.94 9.4,5.18 9.4,1.88 10.19,1.08 U$10.P$1
PA27  (via drill 0.2 pad 0.51)
  Top 0.152: IC.25 10.04,8.17 9.86,8.36 9.68,8.36 v9.3,8.69
  Route15 0.254: v9.3,8.69 11.63,8.69 13.36,6.96 13.36,5.74 12.55,4.93 10.97,4.93 10.26,4.22 10.26,3.76 10.72,3.3 10.72,2.64 10.36,2.29 10.36,1.98 11.2,1.15 U$7.P$1
PA28  (via drill 0.2 pad 0.51)
  Top 0.152: IC.27 10.08,9.17 v9.2,10.06
  Route15 0.254: v9.2,10.06 11.58,10.06 14.22,7.42 14.22,5.18 13.16,4.12 13.16,3.1 12.33,2.27 U$48.P$1
PA30/SWCLK  (via drill 0.2 pad 0.51)
  Top 0.152: IC.31 9.81,11.17 v9.55,11.43
  Route2 0.254: R4.1 10.42,16 10.16,16.26 | 10.16,16.26 10.16,17.07 U$46.P$1 | v6.15,9.7 5.33,9.7 5.08,9.96 5.08,12.65 v5.49,13.06 | 10.16,16.26 8.94,16.26 v8.79,16.36
  Route15 0.254: v8.79,16.36 8.79,13.46 8.03,12.7 5.84,12.7 v5.49,13.06
  Bottom 0.254: v9.55,11.43 8.99,11.43 7.42,9.86 6.3,9.86 v6.15,9.7
  other vias: 11.51,16
PA31/SWDIO  (via drill 0.2 pad 0.51)
  Top 0.152: v10.87,13.11 10.87,13.01 10.67,12.8 10.67,11.67 IC.32
  Route15 0.254: v10.87,13.11 10.77,13.11 9.4,14.48 9.4,16.55 U$47.P$1
RESET  (via drill 0.2 pad 0.51)
  Top 0.152: IC.26 10.02,8.67 9.35,9.35 v9.2,9.35
  Top 0.254: R1.2 12.3,3.39 R2.1 C1.1
  Route2 0.254: 9.5,9.35 9.91,8.94 9.91,7.52 10.82,6.6 10.82,5.44 12.19,4.06 R1.2 | 9.5,9.35 v9.2,9.35 | 9.5,9.35 9.55,9.4 13.61,9.4 14.94,10.72 14.94,14.28 13.06,16.15 12.34,16.15 11.62,16.88 U$45.P$1
  other vias: 12.3,4.06
RFN
  Top 0.152: IC.13 4.65,9.67 4.17,10.16 4.17,11.07 3.91,11.33 3.25,11.33 C11.1
RFP  (via drill 0.2 pad 0.51)
  Top 0.152: IC.12 4.71,10.17 4.52,10.36 4.52,11.33 3.86,11.99 2.69,11.99 v2.49,12.19
  Bottom 0.152: C12.1 2.31,12.01 v2.49,12.19
  other vias: 2.31,7.04
VDDANA  (via drill 0.2 pad 0.51)
  Top 0.152: IC.4 8.06,11.81 v8.13,11.73
  Top 0.254: C22.2 5.28,13.82 L6.2
  Route2 0.254: C8.1 12.8,14.17 12.8,14.33 12.14,14.99 9.25,14.99 8.08,13.82 8.08,11.79 v8.13,11.73
  Route15 0.254: v8.13,11.73 8.33,11.53 8.33,11.07 8.03,10.77 7.21,10.77 6.86,11.12 6.86,11.89 6.6,12.14 5.49,12.14 4.65,12.98 L6.2
  other vias: 4.65,13.18 12.8,13.97
VDDCORE
  Top 0.152: IC.29 11.6,10.17 11.99,10.57 11.99,11.02 11.23,11.79 11.23,12.3 C9.1
VIN  (via drill 0.2 pad 0.51)
  Top 0.14: C7.1 8.63,1.87 8.48,1.73 7.57,1.73 7.47,1.83 6.28,1.83 U$1.P$1
  Top 0.203: USB.1 12.75,7.72 12.65,7.62 12.65,6.1 v12.39,5.84 | LDO_VREG.VIN v8.64,3.08 | C6.1 8.63,3.08 v8.64,3.08 | C7.1 v8.63,3.07 v8.64,3.08
  Route15 0.203: v8.64,3.08 9.07,3.08 9.35,3.35 9.35,4.32 10.87,5.84 v12.39,5.84
XTALIN
  Top 0.152: 7.54,14.07 XOSCRF.1 8,13.66 8.18,13.66 8.53,13.31 8.84,13.31 9.06,13.09 IC.2
  Top 0.254: C14.2 6.33,14.3 6.55,14.07 7.54,14.07
XTALOUT  (via drill 0.2 pad 0.51)
  Top 0.152: XOSCRF.3 9.82,15.7 | IC.1 9.93,12.57 v10.16,12.8
  Top 0.203: 9.82,15.7 10.06,15.7 11.12,14.63 C15.1
  Route2 0.254: v10.16,12.8 10.16,14.17 10.43,14.45 C15.1
  other vias: 11.13,14.45

### Text on the board
tPlace: r2.0 | FemtoBeacon | Femto.io
bPlace: 09/I2C | 08/I2C | 07 | 06 | 30/SWCLK | RESET | 31/SWDIO | 15/BOOT | 16/I2C | 17/I2C | 19/FS | 27 | 28 | 18/INT | VIN | 3V3 | 24 U- | 25/U+ | GND